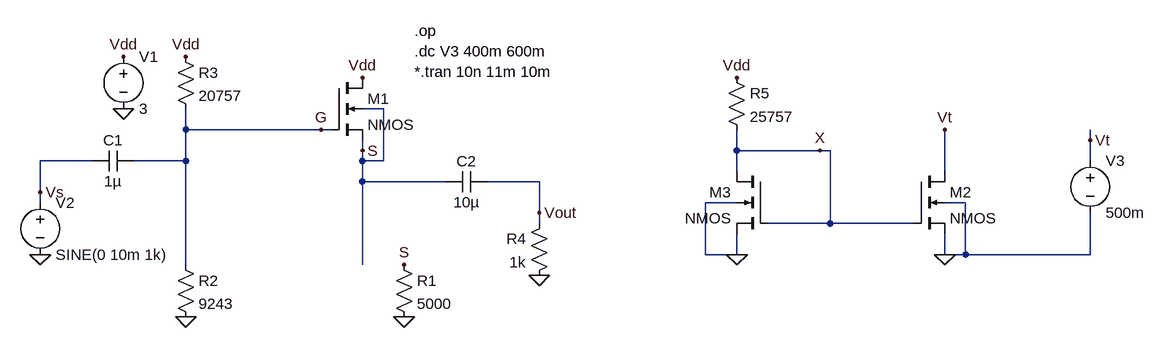
[diagram p0: schematic Draft1.asc]
Draft1.asc, the LTspice schematic file:
Version 4
SHEET 1 1228 680
WIRE 48 208 16 208
WIRE -256 240 -256 208
WIRE -48 240 -256 240
WIRE -32 240 -48 240
WIRE 1136 256 1136 240
WIRE 16 272 16 256
WIRE 592 272 592 240
WIRE 720 272 592 272
WIRE 736 272 720 272
WIRE -400 288 -480 288
WIRE -256 288 -256 240
WIRE -256 288 -336 288
WIRE 16 288 16 272
WIRE 48 288 48 208
WIRE 48 288 16 288
WIRE 1136 288 1136 256
WIRE 592 304 592 272
WIRE 912 304 912 240
WIRE 16 320 16 288
WIRE 144 320 16 320
WIRE 288 320 208 320
WIRE -480 336 -480 288
WIRE -480 352 -480 336
WIRE 592 352 544 352
WIRE 944 352 912 352
WIRE 288 368 288 320
WIRE 288 384 288 368
WIRE 736 384 736 272
WIRE 736 384 640 384
WIRE 864 384 736 384
WIRE 544 432 544 352
WIRE 592 432 592 400
WIRE 592 432 544 432
WIRE 912 432 912 400
WIRE 944 432 944 352
WIRE 944 432 912 432
WIRE 1136 432 1136 368
WIRE 1136 432 944 432
WIRE -256 448 -256 288
WIRE 16 448 16 320
FLAG -352 128 Vdd
FLAG -256 128 Vdd
FLAG 16 160 Vdd
FLAG -352 208 0
FLAG -256 528 0
FLAG -48 240 G
FLAG 16 272 S
FLAG -480 432 0
FLAG 288 464 0
FLAG 80 528 0
FLAG 592 160 Vdd
FLAG 592 432 0
FLAG 912 432 0
FLAG 1136 256 Vt
FLAG -480 336 Vs
FLAG 288 368 Vout
FLAG 720 272 X
FLAG 80 448 S
FLAG 912 240 Vt
DATAFLAG -160 240 "$"
DATAFLAG 16 368 "$"
DATAFLAG 752 384 "$"
SYMBOL Res 64 432 R0
SYMATTR InstName R1
SYMATTR Value 5000
SYMBOL Res -272 432 R0
SYMATTR InstName R2
SYMATTR Value 9243
SYMBOL Res -272 112 R0
SYMATTR InstName R3
SYMATTR Value 20757
SYMBOL voltage -352 112 R0
SYMATTR InstName V1
SYMATTR Value 3
SYMBOL nmos4 -32 160 R0
SYMATTR InstName M1
SYMATTR Value2 l=0.18 w=10
SYMBOL voltage -480 336 R0
SYMATTR InstName V2
SYMATTR Value SINE(0 10m 1k)
SYMBOL Cap -400 272 M90
WINDOW 0 0 32 VBottom 2
WINDOW 3 32 32 VTop 2
SYMATTR InstName C1
SYMATTR Value 1µ
SYMBOL Cap 144 304 M90
WINDOW 0 0 32 VBottom 2
WINDOW 3 32 32 VTop 2
SYMATTR InstName C2
SYMATTR Value 10µ
SYMBOL Res 304 368 M0
SYMATTR InstName R4
SYMATTR Value 1k
SYMBOL nmos4 864 304 R0
SYMATTR InstName M2
SYMATTR Value2 l=0.18 w=10
SYMBOL nmos4 640 304 M0
SYMATTR InstName M3
SYMATTR Value2 l=0.18 w=10
SYMBOL Res 576 144 R0
SYMATTR InstName R5
SYMATTR Value 25757
SYMBOL Voltage 1136 272 R0
SYMATTR InstName V3
SYMATTR Value 500m
TEXT 96 88 Left 2 !.op\n.dc V3 400m 600m\n*.tran 10n 11m 10m

The netlist it stands for:
* Draft1.asc
R1 S 0 5000
R2 G 0 9243
R3 Vdd G 20757
V1 Vdd 0 3
M1 Vdd G S S NMOS l=0.18 w=10
V2 Vs 0 SINE(0 10m 1k)
C1 Vs G 1µ
C2 S Vout 10µ
R4 Vout 0 1k
M2 Vt X 0 0 NMOS l=0.18 w=10
M3 X X 0 0 NMOS l=0.18 w=10
R5 Vdd X 25757
V3 Vt 0 500m
.model NMOS NMOS
.model PMOS PMOS
.lib standard.mos
.op
.dc V3 400m 600m
*.tran 10n 11m 10m
.backanno
.end